# EAGLE design Test-plug (EAGLE 9.6.2)
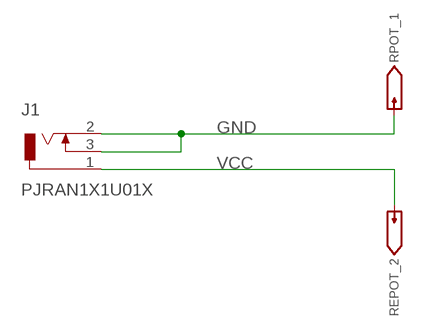
[diagram p0: schematic, sheet 1]

## Parts
J1  PJRAN1X1U01X  [PJRAN1X1U01X]
REPOT_2  TESTPAD/W_HOLE_1X1  [DIODE_GHI2_TESTPAD/W_HOLE_1X1]
RPOT_1  TESTPAD/W_HOLE_1X1  [DIODE_GHI2_TESTPAD/W_HOLE_1X1]

## Nets
GND: J1.2 J1.3 RPOT_1.P$1(TP)
VCC: J1.1 REPOT_2.P$1(TP)

## Library data of the parts
J1 = Connectors:PJRAN1X1U01X: CONN RCA JACK MONO 3.2MM R/A Manufacturer's datasheet <http://www.switchcraft.com/Drawings/pjran1x1u__x_series_cd.pdf>; CREATED_BY: PCBLayout.com; DIGIKEY_PART_NUMBER: PJRAN1X1U01X-ND; MANUFACTURER: Switchcraft Inc.; MPN: PJRAN1X1U01X
REPOT_2 RPOT_1 = BeagleBone_Blue_R3:TESTPAD/W_HOLE_1X1

## Board
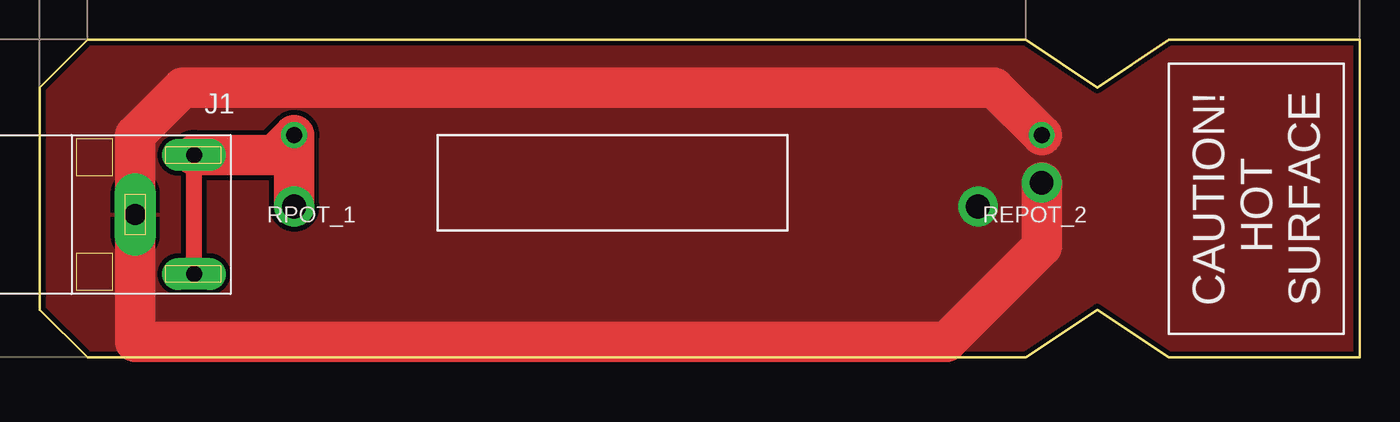
[diagram p1: board, top side]
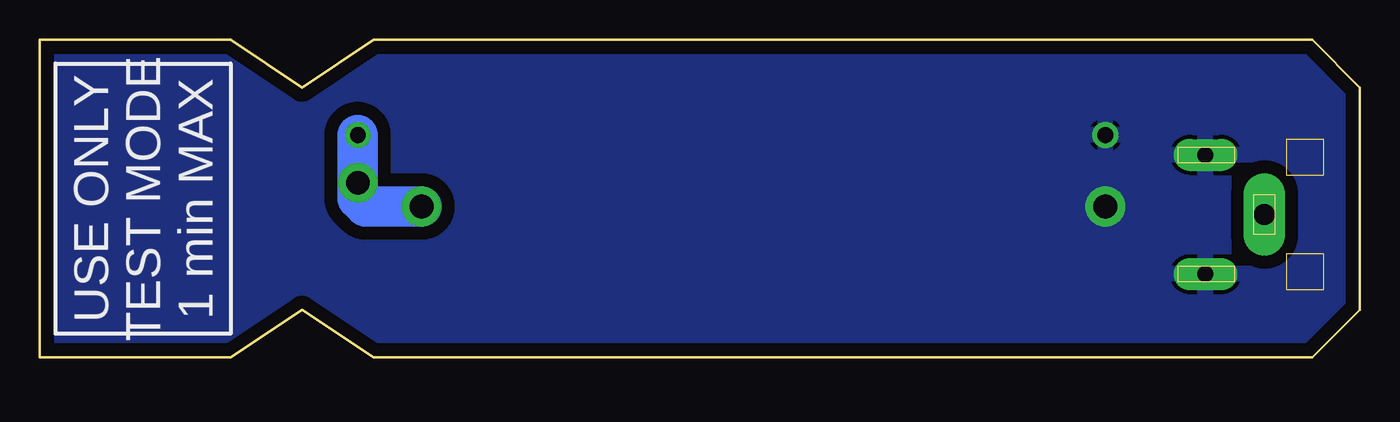
[diagram p2: board, bottom side, seen from below]

Size 83 x 20 mm. Coordinates in mm from the lower left corner, seen from the top.
Outline: 62,20 3,20 0,17 0,3 3,0 62,0 66.5,3 71,0 83,0 83,20 71,20 66.5,17 62,20
Copper layers (1*16): Top 0.035mm / dielectric 1.5mm / Bottom 0.035mm
Design rules "default *": minimum track width 6mil, minimum drill 0.25mm, track to track 8mil, track to pad 8mil, pad to pad 8mil, via to via 8mil, smd to smd 5mil, copper to edge 10mil, drill to drill 8mil, minimum pad ring 10mil, minimum via ring 8mil, stop-mask expansion 2mil, vias tented up to drill 20mil, thermal gap 10mil

### Footprints (pad centres in the part's own frame; a part is rotated, then mirrored left to right if it is on the bottom)
PJRAN1X1U01X = drill 1.3 pad 2.6 long: 1 0,0 | drill 1 pad 2 long: 2 3.75,3.7; 3 -3.75,3.7
DIODE_GHI2_TESTPAD/W_HOLE_1X1 = drill 1 pad 1.626: P$1 0,0

### Placement (x,y rotation side)
J1  6,9 270 top
REPOT_2  63,14 0 top
RPOT_1  16,14 0 top

### Tracks (layer width: path | path; a pad name or v marks a point on that pad's centre or on a via)
GND  (via drill 1.5 pad 2.5)
  Top 1.016: J1.2 J1.3
  Top 2.54: J1.3 14.75,12.75 RPOT_1.P$1 v16,9.5
  pour Bottom (isolate 0.813): -2.5,23 -2.5,-3.5 87,-3.5 87,23
VCC  (via drill 1.5 pad 2.5)
  Top 2.54: J1.1 6,1 57,1 63,7 v63,11 | REPOT_2.P$1 60,17 9,17 6,14 6,10
  Bottom 2.54: v59,9.5 62.5,9.5 63,10 v63,11 REPOT_2.P$1
  pour Top (isolate 0.305): -7,23 -7,-3 87,-3 87,23

### Text on the board
tPlace: CAUTION! / HOT / SURFACE
bPlace: USE ONLY / TEST MODE / 1 min MAX